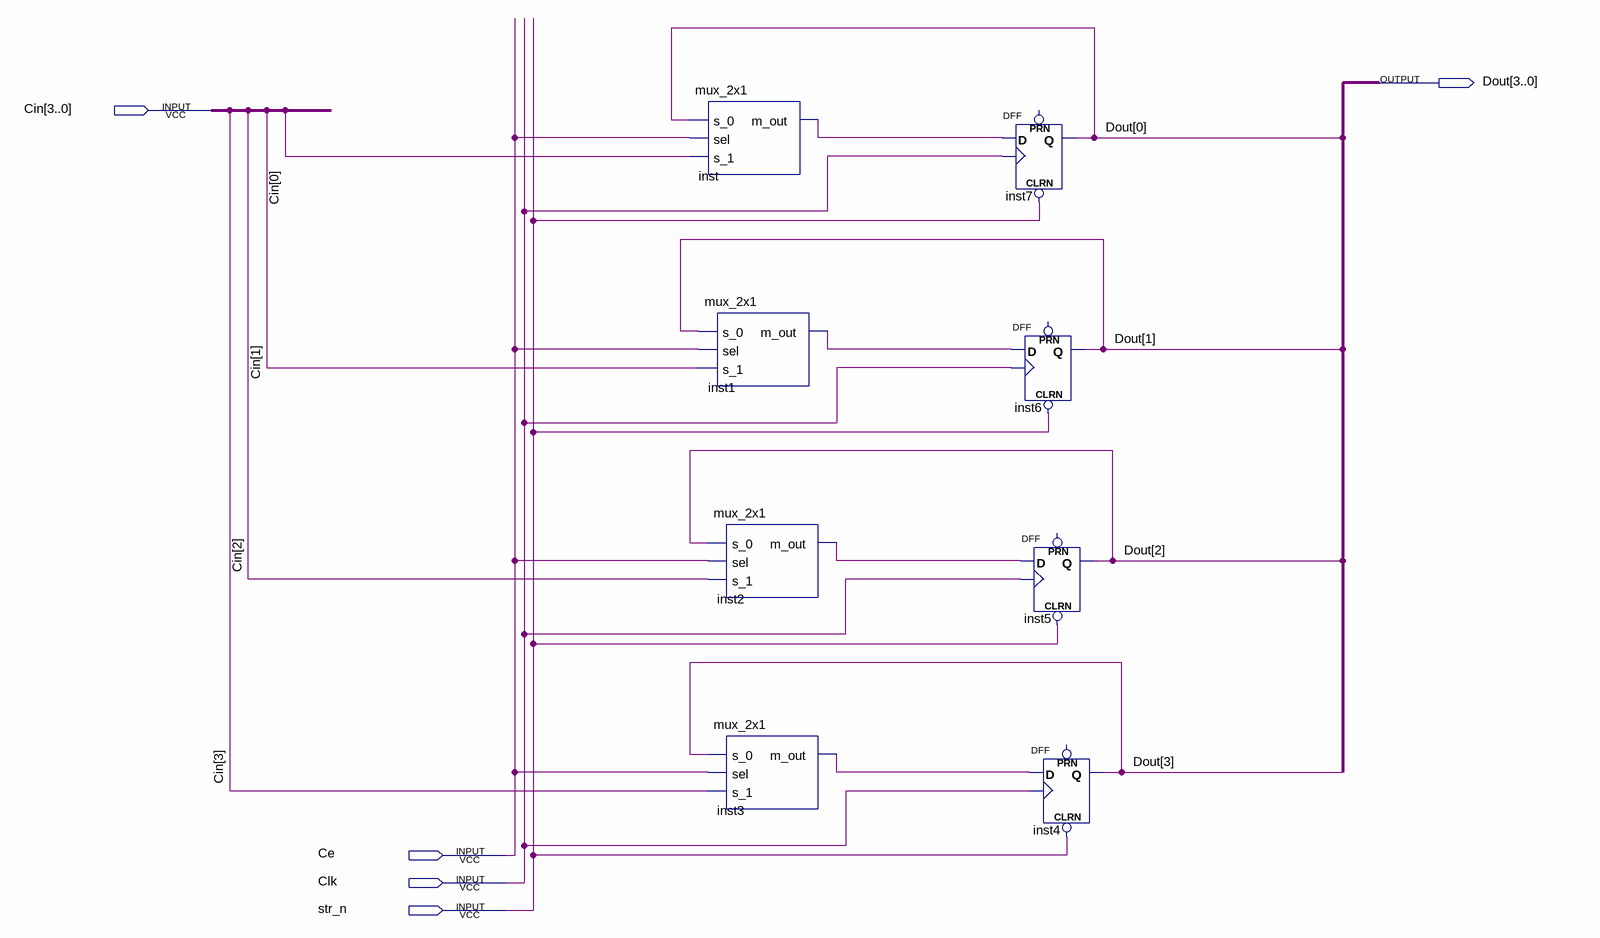
[diagram p0: schematic sheet]
// Quartus schematic four_bir_reg.bdf as structural Verilog: 8 symbols, 5 pins
module four_bir_reg (
  input  [3:0] Cin,
  input  Ce,
  input  Clk,
  input  str_n,
  output [3:0] Dout
);

  wire inst1_m_out, inst2_m_out, inst3_m_out, inst_m_out;

  mux_2x1 inst (.s_0(Dout[0]), .sel(Ce), .s_1(Cin[0]), .m_out(inst_m_out));
  mux_2x1 inst1 (.s_0(Dout[1]), .sel(Ce), .s_1(Cin[1]), .m_out(inst1_m_out));
  mux_2x1 inst2 (.s_0(Dout[2]), .sel(Ce), .s_1(Cin[2]), .m_out(inst2_m_out));
  mux_2x1 inst3 (.s_0(Dout[3]), .sel(Ce), .s_1(Cin[3]), .m_out(inst3_m_out));
  DFF inst7 (.CLRN(str_n), .CLK(Clk), .D(inst_m_out), .Q(Dout[0]));  // open: PRN
  DFF inst6 (.CLRN(str_n), .CLK(Clk), .D(inst1_m_out), .Q(Dout[1]));  // open: PRN
  DFF inst5 (.CLRN(str_n), .CLK(Clk), .D(inst2_m_out), .Q(Dout[2]));  // open: PRN
  DFF inst4 (.CLRN(str_n), .CLK(Clk), .D(inst3_m_out), .Q(Dout[3]));  // open: PRN
endmodule
